# Altium schematic sheet data2.SchDoc
size 297 x 209 mm
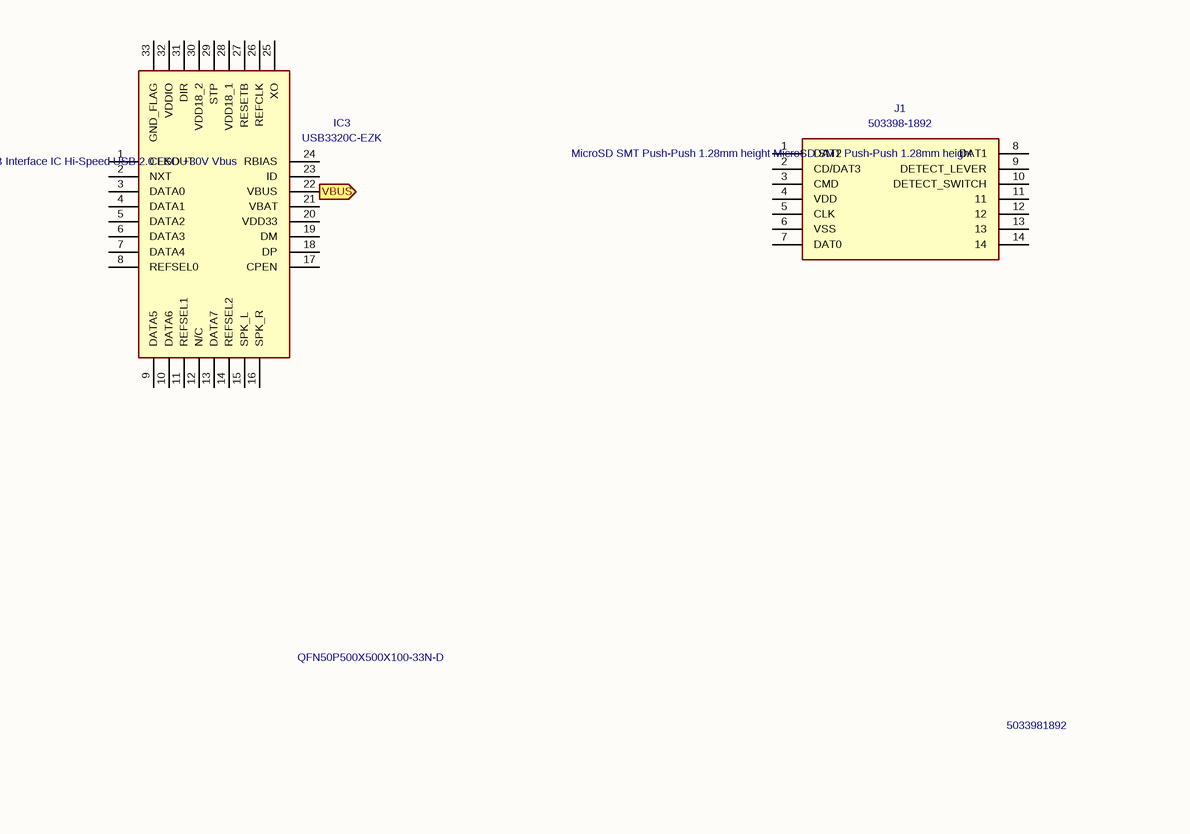
[diagram p0: data2.SchDoc, top]
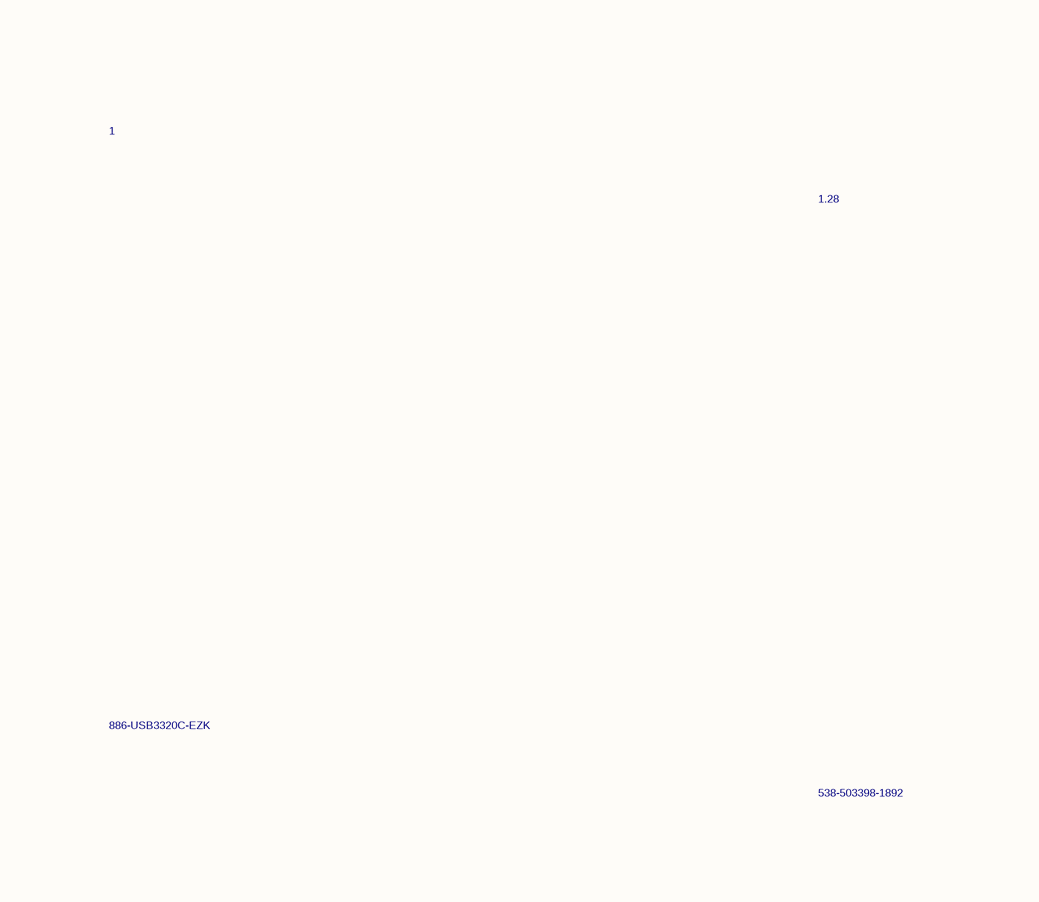
[diagram p1: data2.SchDoc, centre]
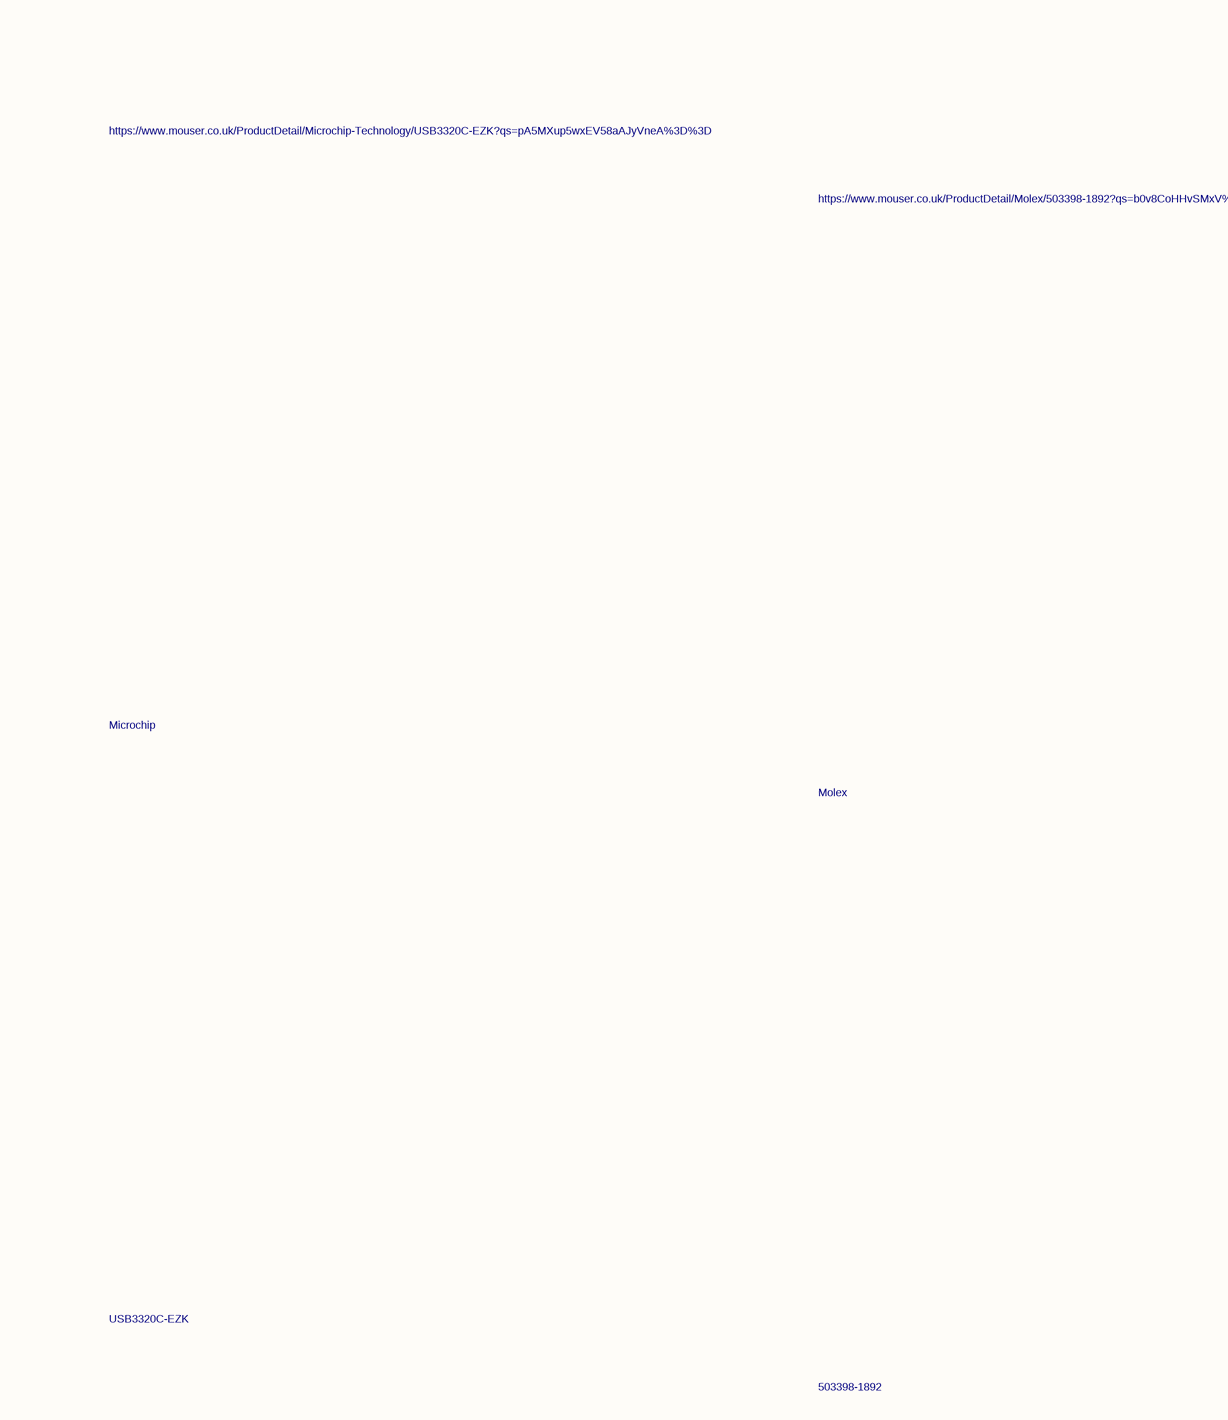
[diagram p2: data2.SchDoc, bottom]

## Parts
IC3  Description: USB Interface IC Hi-Speed USB 2.0 ESD +30V Vbus  Height: 1  Mouser Part Number: 886-USB3320C-EZK  Manufacturer_Name: Microchip  [QFN50P500X500X100-33N-D]  (hidden comment: USB3320C-EZK)
J1  Description: MicroSD SMT Push-Push 1.28mm height MicroSD SMT Push-Push 1.28mm height  Height: 1.28  Mouser Part Number: 538-503398-1892  Manufacturer_Name: Molex  [5033981892]  (hidden comment: 503398-1892)

## Ports
VBUS (in)

## Nets
VBUS: IC3.22(VBUS) ; port VBUS

Not connected (* = marked no-connect by the designer): IC3 1(CLKOUT) 2(NXT) 3(DATA0) 4(DATA1) 5(DATA2) 6(DATA3) 7(DATA4) 8(REFSEL0) 9(DATA5) 10(DATA6) 11(REFSEL1) 12(N/C) 13(DATA7) 14(REFSEL2) 15(SPK_L) 16(SPK_R) 17(CPEN) 18(DP) 19(DM) 20(VDD33) 21(VBAT) 23(ID) 24(RBIAS) 25(XO) 26(REFCLK) 27(RESETB) 28(VDD18_1) 29(STP) 30(VDD18_2) 31(DIR) 32(VDDIO) 33(GND_FLAG); J1 1(DAT2) 2(CD/DAT3) 3(CMD) 4(VDD) 5(CLK) 6(VSS) 7(DAT0) 8(DAT1) 9(DETECT_LEVER) 10(DETECT_SWITCH) 11 12 13 14

## Notes on the sheet
- 1
- 2
- 3
- 4
- 5
- 6
- A
- B
- C
- D
- Title:
- File: data2.kicad_sch
- Sheet: /
- KiCad E.D.A.  kicad (5.1.4)-1
- Size: A4
- Date:
- Rev:
- Id: 1/1

## Library data of the parts
IC3 = USB3320C-EZK: Mouser Price/Stock: https://www.mouser.co.uk/ProductDetail/Microchip-Technology/USB3320C-EZK?qs=pA5MXup5wxEV58aAJyVneA%3D%3D; Manufacturer_Part_Number: USB3320C-EZK; Value: USB3320C-EZK
J1 = 503398-1892: Mouser Price/Stock: https://www.mouser.co.uk/ProductDetail/Molex/503398-1892?qs=b0v8CoHHvSMxV%252BW12iKaSg%3D%3D; Manufacturer_Part_Number: 503398-1892; Value: 503398-1892